# Altium project PCB_PowerSupply_1A - Copy.PrjPcb
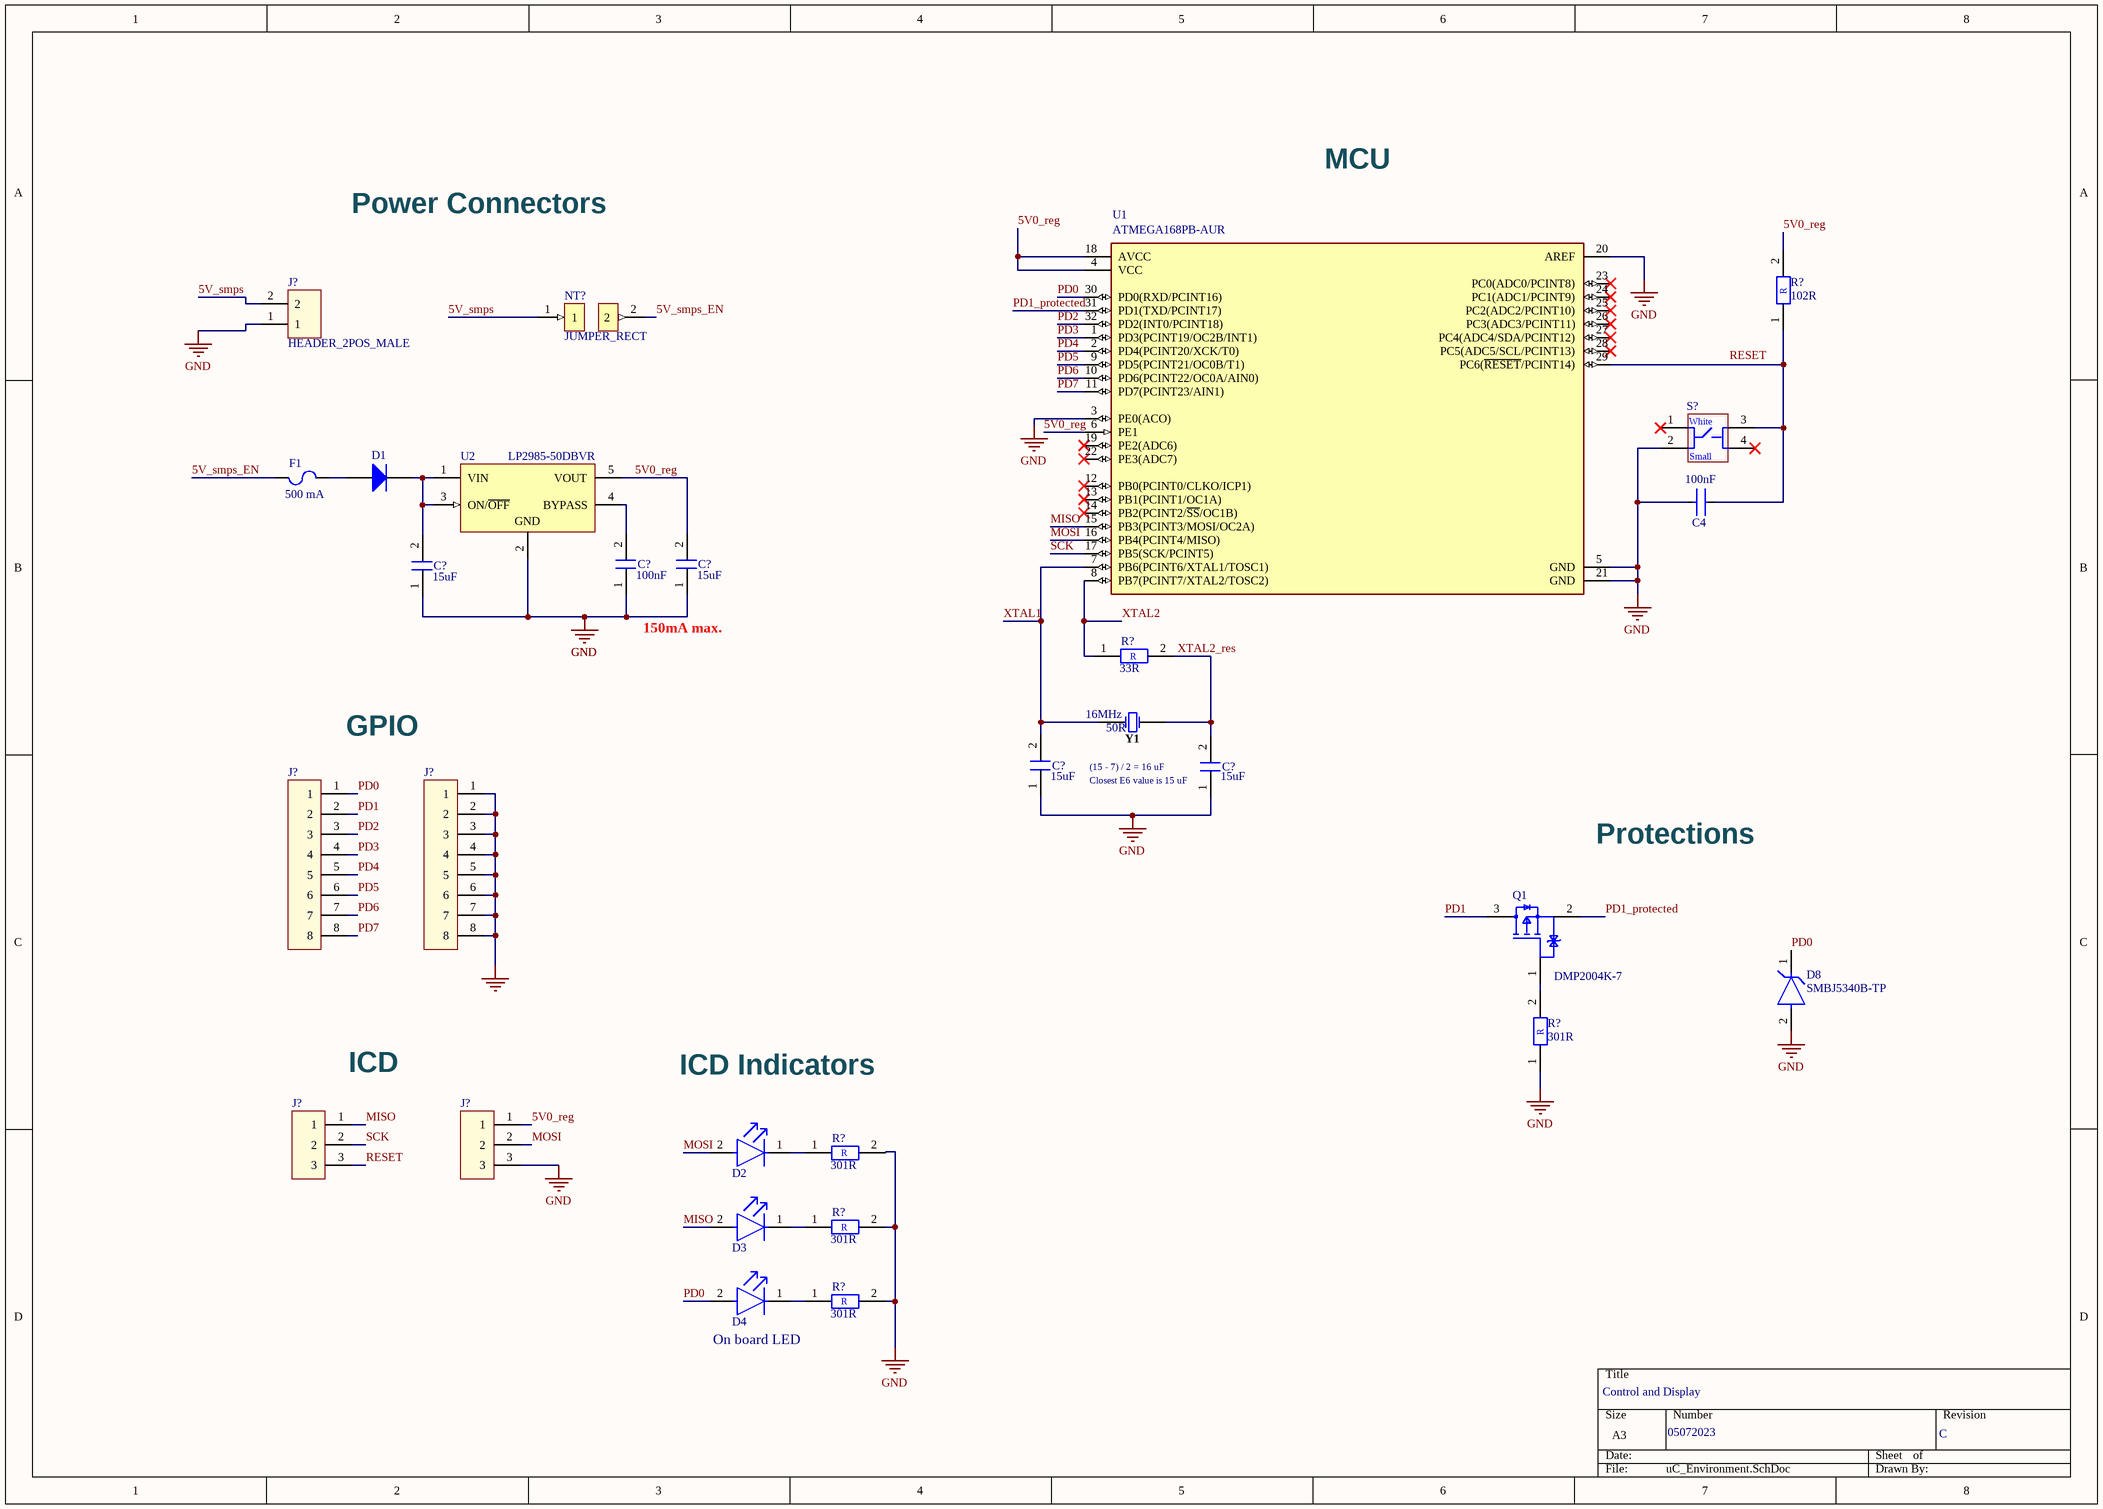
[diagram p0: uC_Environment.SchDoc]
PCB_CHECKER: - -----; PCB_CHECKER_APP_DATE: --/--/----; PCB_DESIGNER: Gustavo H. Meza; PCB_DWG_NO: <PCB DWG NO>; PCB_PART_NUMBER: <PCB PN>; PCB_REV: A; SCH_REV: A
3 sheets, 120 parts. Net scope: flat (ports and power ports of the same name join across sheets).
Board file: group1.PcbDoc
Sheets:
  uC_Environment.SchDoc
  Power_Distribution.SchDoc
  pulse_generator_pen.SchDoc

## Sheet uC_Environment.SchDoc
size A3; SheetNumber: 1; SheetTotal: 3; ENG_APP_DATE: --/--/--; DSN_APP_DATE: --/--/--; CHK_APP_DATE: --/--/--

### Parts
(Parts that share a designator on the sheet are numbered #1, #2 ... from top to bottom, then left to right.)
C4  Capacitance: 100nF  [FP-CL21-IPC_A]  (hidden comment: CL21B104KBCNNNC)
C?#1  Capacitance: 15uF  [0805_R]  (hidden comment: P.N.)
C?#2  Capacitance: 100nF  [0805_R]  (hidden comment: P.N.)
C?#3  Capacitance: 15uF  [0805_R]  (hidden comment: P.N.)
C?#4  Capacitance: 15uF  [0805_R]  (hidden comment: P.N.)
C?#5  Capacitance: 15uF  [0805_R]  (hidden comment: P.N.)
D1  SMAJ30A-E3/61  [VISH-DO-214AC-2_N]  (value not drawn)
D2  LTST-C191TBKT  [FP-LTST-C191TBKT-MFG]  (value not drawn)
D3  LTST-C191TBKT  [FP-LTST-C191TBKT-MFG]  (value not drawn)
D4  LTST-C191TBKT  [FP-LTST-C191TBKT-MFG]  (value not drawn)
D8  SMBJ5340B-TP  [FP-DO-214AA-MFG]
F1  Parameter 1: 500 mA  [0ZCJ0050AF2E-Footprint-1]  (hidden comment: 0ZCJ0050AF2E)
J?#1  HEADER_2POS_MALE  [HEADER_2POS_MALE_VERT_2.54MM]
J?#2  HEADER_8POS_MALE  [HEADER_8POS_MALE_VERT_2.54MM]  (value not drawn)
J?#3  HEADER_8POS_MALE  [HEADER_8POS_MALE_VERT_2.54MM]  (value not drawn)
J?#4  HEADER_3POS_MALE  [HEADER_3POS_MALE_VERT_2.54MM]  (value not drawn)
J?#5  HEADER_3POS_MALE  [HEADER_3POS_MALE_VERT_2.54MM]  (value not drawn)
NT?  JUMPER_RECT
Q1  DMP2004K-7  [FP-SOT23-MFG]
R?#1  Resistance: 102R  [0805_R]  (hidden comment: P.N.)
R?#2  Resistance: 33R  [0805_R]  (hidden comment: P.N.)
R?#3  Resistance: 301R  [0805_R]  (hidden comment: P.N.)
R?#4  Resistance: 301R  [0805_R]  (hidden comment: P.N.)
R?#5  Resistance: 301R  [0805_R]  (hidden comment: P.N.)
R?#6  Resistance: 301R  [0805_R]  (hidden comment: P.N.)
S?  TACT_SWITCH_SMD_5x3MM  [TACT_SWITCH_SMD_5x3MM]  (value not drawn)
U1  ATMEGA168PB-AUR  [FP-32A-MFG]
U2  LP2985-50DBVR  [DBV0005A_M]
Y1  Frequency: 16MHz  ESR (Equivalent Series Resistance): 50R  [ECS-160-20-3X-EN-TR-Footprint-1]  (hidden comment: ECS-160-20-3X-EN-TR)

### Nets
GND: C4.1 C?#1.1 C?#2.1 C?#3.1 C?#4.1 C?#5.1 D8.2(A) J?#1.1 J?#3.1 J?#3.2 J?#3.3 J?#3.4 J?#3.5 J?#3.6 J?#3.7 J?#3.8 J?#5.3 R?#3.1 R?#4.2 R?#5.2 R?#6.2 S?.2 U1.3(PE0(ACO)) U1.5(GND) U1.20(AREF) U1.21(GND) U2.2(GND)
5V0_reg: C?#3.2 J?#5.1 R?#1.2 U1.4(VCC) U1.6(PE1) U1.18(AVCC) U2.5(VOUT)
5V_smps: J?#1.2 NT?.1
5V_smps_EN: F1.1(IN) NT?.2
MISO: D3.2(A) J?#4.1 U1.15(PB3(PCINT3/MOSI/OC2A))
MOSI: D2.2(A) J?#5.2 U1.16(PB4(PCINT4/MISO))
PD0: D4.2(A) D8.1(C) J?#2.1 U1.30(PD0(RXD/PCINT16))
PD1: J?#2.2 Q1.3(D)
PD1_protected: Q1.2(S) U1.31(PD1(TXD/PCINT17))
PD2: J?#2.3 U1.32(PD2(INT0/PCINT18))
PD3: J?#2.4 U1.1(PD3(PCINT19/OC2B/INT1))
PD4: J?#2.5 U1.2(PD4(PCINT20/XCK/T0))
PD5: J?#2.6 U1.9(PD5(PCINT21/OC0B/T1))
PD6: J?#2.7 U1.10(PD6(PCINT22/OC0A/AIN0))
PD7: J?#2.8 U1.11(PD7(PCINT23/AIN1))
RESET: J?#4.3
SCK: J?#4.2 U1.17(PB5(SCK/PCINT5))
XTAL1: C?#4.2 U1.7(PB6(PCINT6/XTAL1/TOSC1)) Y1.2
XTAL2: R?#2.1 U1.8(PB7(PCINT7/XTAL2/TOSC2))
XTAL2_res: C?#5.2 R?#2.2 Y1.1
NetC4_2: C4.2 R?#1.1 S?.3 U1.29(PC6(~{RESET}/PCINT14))
NetC?#1_2: C?#1.2 D1.1(K) U2.1(VIN) U2.3(ON/~{OFF})
NetC?#2_2: C?#2.2 U2.4(BYPASS)
NetD1_2: D1.2(A) F1.2(OUT)
NetD2_1: D2.1(C) R?#4.1
NetD3_1: D3.1(C) R?#5.1
NetD4_1: D4.1(C) R?#6.1
NetQ1_1: Q1.1(G) R?#3.2

Not connected (* = marked no-connect by the designer): S? 1* 4*; U1 12(PB0(PCINT0/CLKO/ICP1))* 13(PB1(PCINT1/OC1A))* 14(PB2(PCINT2/~{SS}/OC1B))* 19(PE2(ADC6))* 22(PE3(ADC7))* 23(PC0(ADC0/PCINT8))* 24(PC1(ADC1/PCINT9))* 25(PC2(ADC2/PCINT10))* 26(PC3(ADC3/PCINT11))* 27(PC4(ADC4/SDA/PCINT12))* 28(PC5(ADC5/SCL/PCINT13))*

### Notes on the sheet
- MCU
- Power Connectors
- (near C?#3) 150mA max.
- GPIO
- (15 - 7) / 2 = 16 uF
- (near C?#5) Closest E6 value is 15 uF
- Protections
- (near J?#4) ICD
- ICD Indicators
- On board LED
- Control and Display
- 05072023
- C
- Labels drawn without touching a wire or pin: RESET
- DWG. NO.
- REV.
- SHT.
- THIS DOCUMENT AND THE DATA DISCLOSED HEREIN OR HEREWITH IS THE PROPERTY OF ALTIUM LIMITED AND MAY BE FREELY DISTRIBUTED IN WHOLE. NO RIGHTS ARE RESERVED OR EXPRESS OR IMPLIED WARANTEE GIVEN.
- REVISION
- DESCRIPTION
- DATE
- APPROVED
- ENG:
- APPROVALS
- PROJECT
- DSN:
- CHK:
- REFERENCE DOCUMENTS
- PROJECT REVISION:
- TITLE
- DOCUMENT REVISION:
- DESIGN ITEM:
- BOM:
- FAB DWG:
- PCB DWG:
- ASSY DWG:
- SCALE:
- SIZE
- B
- CAGE CODE
- FILE NAME
- DWG NO.
- SHEET
- OF
- REV
- (in symbol 0805_R) R
- (in symbol TACT_SWITCH_SMD_5x3MM) White; Small

### Library data of the parts
C4 = CMP-2000-05017-2: CL21 Series 0805 100nF 50V ±10% Tolerance X7R Multilayer Ceramic Chip Capacitor; Depth: 1.25mm; Height: 0.85mm; Width: 0.049inch; Tolerance: 10%; Case Code (Metric): 2012; Case Code (Imperial): 0805; Material: Ceramic; Thickness: 0.037inch; Min Operating Temperature: -55°C; Contact Plating: Tin; Length: 2mm; Mount: Surface Mount; Voltage Rating (DC): 50V; Lead Free: Lead Free; Dielectric: X7R; Radiation Hardening: No; Voltage Rating: 50V; Case/Package: 0805; Packaging: Tape and Reel; Max Operating Temperature: 125°C; Voltage: 50V
C?#1-C?#5 = 0805_C: Generic 0805 Capacitor; Voltage Rating: 10V; Dielectric: XR7
D1 = CMP-0548-00228-2: Transient Voltage Suppressor, 6.40 to 231 V, 30 V Stand-off Voltage, Uni-Directional, -55 to 155 degC, 2-pin DO-214AC, Pb-Free, Tape and Reel; Manufacturer: Vishay Semiconductor; ID (uA): 1; VWM (V): 30; IFSM: 40 A; PPPM (W): 400, 300; VBR Uni-Directional (V): 6.4 to 231; Mounting Technology: Surface Mount; Packing: Tape and Reel; ComponentLink1URL: http://www.vishay.com/; ComponentLink3URL: http://www.vishay.com/docs/88390/smaj50a.pdf; DatasheetVersion: 12/8/2013; RoHS: TRUE; PartNumber: SMAJ30A-E3/61; PackageReference: DO-214AC-2; ComponentLink2URL: http://www.vishay.com/docs/88390/smaj50a.pdf; ComponentLink1Description: Manufacturer URL; Operating Junction and Storage Temperature Range: -55 to 150 degC; PackageDescription: 2-Pin DO-214AC (SMA), Body 4.245 x 2.665 mm; ComponentLink3Description: Package Specification; ComponentLink2Description: Datasheet
D2-D4 = CMP-22017-000008-1: LED BLUE CLEAR CHIP SMD; Lens Color: Colorless; Dominant Wavelength: 475nm; Forward Current: 20mA; Wavelength: 468nm; Viewing Angle: 130°; Power Dissipation: 76mW; Luminous Intensity: 180mcd; Reverse Voltage: 5V; Number of Elements: 1; Lens Style: Diffused; Forward Voltage: 3.8V; Max Power Dissipation: 75mW; Case Code (Metric): 1608; Packaging: Tape and Reel; Case/Package: 0603; Depth: 1.6mm; Mount: Surface Mount; Lead Free: Lead Free; Min Operating Temperature: -20°C; Lens Transparency: Clear; Illumination Color: Blue; Height: 0.55mm; Test Current: 20mA; Case Code (Imperial): 0603; Max Operating Temperature: 80°C; Number of Pins: 2; Length: 0.8mm; Radiation Hardening: No; Package Quantity: 1; Number of LEDs: 1; Width: 0.8mm; Color: Blue
D8 = CMP-56208-000001-1: DIODE ZENER 6V 5W DO214AA; Manufacturer: Micro Commercial Components; Zener Impedance: 1Ω; Max Reverse Leakage Current: 1uA; Max Junction Temp: +150°C; Forward Current: 1A; Standoff Height: 0.05mm; Package: DO-214AA; Mouser Description: SMBJ Series 5 W 6 V 1 A Zener Diode-DO-214AA; Device Class L3: Zener Diodes; RoHS: TRUE; Power Dissipation: 5W; Nom Zener Voltage: 6V; Temperature Range High: +150°C; Lead Free: Yes; Category: Diode; Temperature: -55°C to +150°C; Height: 2.41mm; Automotive: No; Digikey Description: DIODE ZENER 6V 5W DO214AA; ComponentLink2Description: Datasheet; Octopart: https://octopart.com/smbj5340b-tp-mcc-19246153; ComponentLink2URL: https://www.mccsemi.com/pdf/Products/SMBJ5338B-SMBJ5388B%28SMB%29.pdf; Manufacturer Part Number: SMBJ5340B-TP; Temperature Range Low: -55°C; Device Class L1: Discrete Semiconductors; Device Class L2: Diodes
F1 = CMP-005-00013-2: PTC Resettable Fuse 0.5A(hold) 1A(trip) 24VDC 100A 0.6W 0.1s 0.15Ohm SMD Solder Pad 3.5 X 1.8 X 1.3mm T/R; Approvals: UL,TUV; Case Code (Metric): 3216; Case Code (Imperial): 1206; Case/Package: 1206
NT? = JUMPER_RECT: Small rectangular jumper
Q1 = CMP-12801-000029-1: MOSFET P-CH 20V 600MA SOT23-3; Manufacturer: Diodes Inc.; Max Junction Temp: +150°C; Turn On Delay Time: 8.5ns; Gate To Source Voltage: 8V; Input Capacitace At Vds: 175pF @ -16V; Rthja Max: 227°C/W; Drain To Source Resistance: 1.1Ω; Turn Off Delay Time: 20.2ns; Standoff Height: 0.013mm; Drain To Source Breakdown Voltage: -20V; Number Of P Channels: 1; Power Dissipation: 550mW; Pulse Drain Current: -1.9A; Depletion Mode: False; Max Forward Diode Voltage: -1.2V; Threshold Vgs Min: -0.5V; Threshold Vgs Max: -1V; Continuous Drain Current: -600mA; Manufacturer Part Number: DMP2004K-7; Height: 1.1mm; ComponentLink2Description: Datasheet; ComponentLink2URL: https://www.diodes.com/assets/Datasheets/ds30933.pdf; Package: SOT23; Footprint Url: https://www.diodes.com/assets/Package-Files/SOT23.pdf; Lead Free: Yes; Octopart: https://octopart.com/dmp2004k-7-diodes+inc.-7151877; Digikey Description: MOSFET P-CH 20V 600MA SOT23-3; Device Class L1: Discrete Semiconductors; Drain To Source Voltage: -20V; Mouser Description: MOSFET P-Channel; Number Of Channels: 1; Device Class L3: MOSFETs; Temperature: -55°C to +150°C; Category: Trans; Device Class L2: Transistors; Automotive: No; Temperature Range High: +150°C; RoHS: TRUE; Temperature Range Low: -55°C
R?#1-R?#6 = 0805_R: Generic 0805 Resistor; Power Rating: 0.5W
U1 = CMP-06276-000190-1: IC MCU 8BIT 16KB FLASH 32TQFP; RoHS Compliant: Yes
U2 = CMP-0758-00084-2: Single Output Low Noise LDO, 150 mA, Fixed 5 V Output, 1.5% Tolerance, 2.2 to 16 V Input, Low IQ, 5-Pin SOT-23 (DBV), -40 to 125 degC, Green (RoHS & no Sb/Br), Tape and Reel; Manufacturer: Texas Instruments; Accuracy (%): 1.5; Iout (Max) (A): 0.15; Fixed Output Options (V): 5; Vdo (Typ) (mV): 280; Output Options: Fixed Output; Iq (Typ) (mA): 0.85; DatasheetVersion: SLVS522N; PackageDescription: 5-Pin Plastic Small Outline, Body 2.9 x 1.6 mm, Pitch 0.95 mm; RoHS: TRUE; ComponentLink3URL: http://www.ti.com/litv/pdf/mpds018j; PartNumber: LP2985-50DBVR; PackageReference: DBV0005A; ComponentLink2URL: http://www.ti.com/lit/ds/symlink/lp2985-50.pdf; Mounting Technology: Surface Mount; ComponentLink1Description: Manufacturer URL; Vin (V): 2.2 to 16; ComponentLink3Description: Package Specification; ComponentLink1URL: http://www.ti.com/; PackageVersion: 4073253-4/L; ComponentLink2Description: Datasheet; Packing: Tape and Reel; Operating Temperature Range (degC): -40 to 125
Y1 = CMP-003-00030-1: Crystal 16MHz ±30ppm (Tol) ±50ppm (Stability) 20pF FUND 50Ohm 2-Pin HC-49/USX SMD T/R; Frequency Tolerance: 30ppm; Frequency Stability: 50ppm

## Sheet Power_Distribution.SchDoc
size B; SheetNumber: 2; SheetTotal: 3
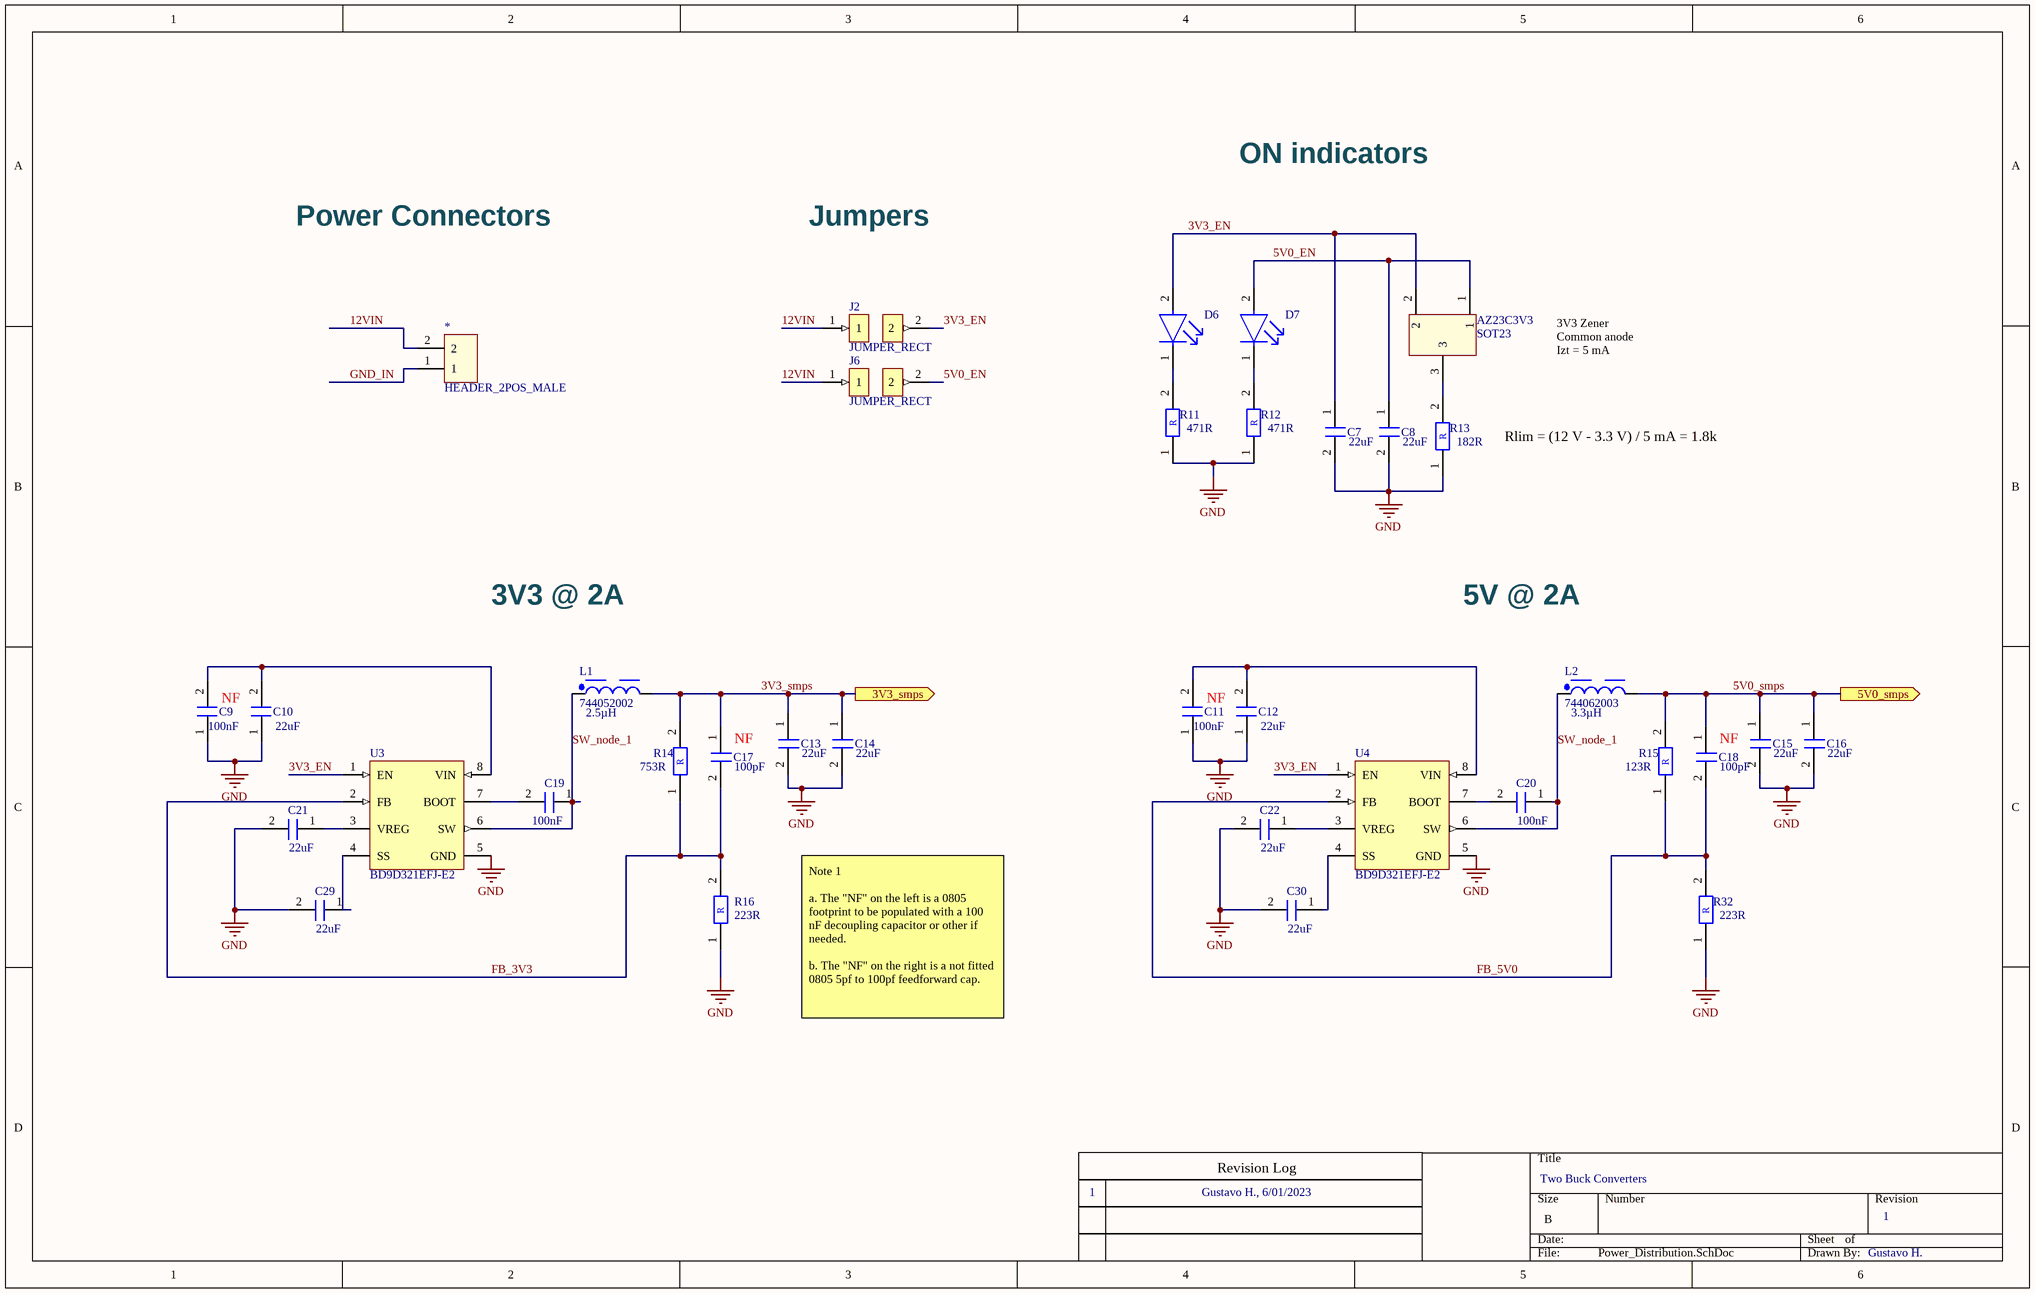
[diagram p1: Power_Distribution.SchDoc]

### Parts
*  HEADER_2POS_MALE  [HEADER_2POS_MALE_VERT_2.54MM]
AZ23C3V3  SOT23  [SOT23]
C7  Capacitance: 22uF  [0805_R]  (hidden comment: P.N.)
C8  Capacitance: 22uF  [0805_R]  (hidden comment: P.N.)
C9  Capacitance: 100nF  [0805_R]  (hidden comment: P.N.)
C10  Capacitance: 22uF  [0805_R]  (hidden comment: P.N.)
C11  Capacitance: 100nF  [0805_R]  (hidden comment: P.N.)
C12  Capacitance: 22uF  [0805_R]  (hidden comment: P.N.)
C13  Capacitance: 22uF  [0805_R]  (hidden comment: P.N.)
C14  Capacitance: 22uF  [0805_R]  (hidden comment: P.N.)
C15  Capacitance: 22uF  [0805_R]  (hidden comment: P.N.)
C16  Capacitance: 22uF  [0805_R]  (hidden comment: P.N.)
C17  Capacitance: 100pF  [0805_R]  (hidden comment: P.N.)
C18  Capacitance: 100pF  [0805_R]  (hidden comment: P.N.)
C19  Capacitance: 100nF  [0805_R]  (hidden comment: P.N.)
C20  Capacitance: 100nF  [0805_R]  (hidden comment: P.N.)
C21  Capacitance: 22uF  [0805_R]  (hidden comment: P.N.)
C22  Capacitance: 22uF  [0805_R]  (hidden comment: P.N.)
C29  Capacitance: 22uF  [0805_R]  (hidden comment: P.N.)
C30  Capacitance: 22uF  [0805_R]  (hidden comment: P.N.)
D6  LTST-C191TBKT  [FP-LTST-C191TBKT-MFG]  (value not drawn)
D7  LTST-C191TBKT  [FP-LTST-C191TBKT-MFG]  (value not drawn)
J2  JUMPER_RECT
J6  JUMPER_RECT
L1  744052002  Inductance: 2.5µH  [WE-TPC_5818]
L2  744062003  Inductance: 3.3µH  [WE-TPC_6823]
R11  Resistance: 471R  [0805_R]  (hidden comment: P.N.)
R12  Resistance: 471R  [0805_R]  (hidden comment: P.N.)
R13  Resistance: 182R  [0805_R]  (hidden comment: P.N.)
R14  Resistance: 753R  [0805_R]  (hidden comment: P.N.)
R15  Resistance: 123R  [0805_R]  (hidden comment: P.N.)
R16  Resistance: 223R  [0805_R]  (hidden comment: P.N.)
R32  Resistance: 223R  [0805_R]  (hidden comment: P.N.)
U3  BD9D321EFJ-E2  [SOIC127P600X100-8N]
U4  BD9D321EFJ-E2  [SOIC127P600X100-8N]

### Ports
3V3_smps (out), 5V0_smps (out)

### Nets
GND: C7.2 C8.2 C9.1 C10.1 C11.1 C12.1 C13.2 C14.2 C15.2 C16.2 C21.2 C22.2 C29.2 C30.2 R11.1 R12.1 R13.1 R16.1 R32.1 U3.5(GND) U4.5(GND)
3V3_EN: AZ23C3V3.2 C7.1 D6.2(A) J2.2 U3.1(EN) U4.1(EN)
3V3_smps: C13.1 C14.1 C17.1 L1.2 R14.2 ; port 3V3_smps
5V0_EN: AZ23C3V3.1 C8.1 D7.2(A) J6.2
5V0_smps: C15.1 C16.1 C18.1 L2.2 R15.2 ; port 5V0_smps
12VIN: *.2 J2.1 J6.1
FB_3V3: C17.2 R14.1 R16.2 U3.2(FB)
FB_5V0: C18.2 R15.1 R32.2 U4.2(FB)
GND_IN: *.1
SW_node_1: C19.1 C20.1 L1.1 L2.1 U3.6(SW) U4.6(SW)
NetAZ23C3V3_3: AZ23C3V3.3 R13.2
NetC9_2: C9.2 C10.2 U3.8(VIN)
NetC11_2: C11.2 C12.2 U4.8(VIN)
NetC19_2: C19.2 U3.7(BOOT)
NetC20_2: C20.2 U4.7(BOOT)
NetC21_1: C21.1 U3.3(VREG)
NetC22_1: C22.1 U4.3(VREG)
NetC29_1: C29.1 U3.4(SS)
NetC30_1: C30.1 U4.4(SS)
NetD6_1: D6.1(C) R11.2
NetD7_1: D7.1(C) R12.2

### Notes on the sheet
- ON indicators
- Power Connectors
- Jumpers
- 3V3 Zener
  Common anode
  Izt = 5 mA
- (near R13) Rlim = (12 V - 3.3 V) / 5 mA = 1.8k
- 3V3 @ 2A
- 5V @ 2A
- (near C9) NF
- (near C11) NF
- (near C17) NF
- (near C18) NF
- Note 1
  a. The "NF" on the left is a 0805 footprint to be populated with a 100 nF decoupling capacitor or other if needed.
  b. The "NF" on the right is a not fitted 0805 5pf to 100pf feedforward cap.
- Two Buck Converters
- 1
- Gustavo H., 6/01/2023
- Gustavo H.
- Revision Log
- (in symbol 0805_R) R

### Library data of the parts
C7-C22 C29 C30 = 0805_C: as C?#1 on sheet uC_Environment
D6 D7 = CMP-22017-000008-1: as D2 on sheet uC_Environment; Case Code (Metric): 1608; Packaging: Tape and Reel; Case/Package: 0603; Depth: 1.6mm; Mount: Surface Mount; Lead Free: Lead Free; Min Operating Temperature: -20°C; Lens Transparency: Clear; Illumination Color: Blue; Height: 0.55mm; Test Current: 20mA; Case Code (Imperial): 0603; Max Operating Temperature: 80°C; Number of Pins: 2; Length: 0.8mm; Radiation Hardening: No; Package Quantity: 1; Number of LEDs: 1; Width: 0.8mm; Color: Blue
J2 J6 = JUMPER_RECT: Small rectangular jumper
L1 = CMP-0227-00410-3: NexarPartId: 22866863; Self Resonant Frequency: 85MHz; Inductance Tolerance: 30%; DC Resistance (DCR): 30mΩ; Current Rating: 2.4A; Height: 1.8mm; Ambient Temperature Range Low: -40°C; Min Operating Temperature: -40°C; Packaging: Cut Tape (CT); Number of Pins: 2; Length: 5.8mm; RoHS: Compliant; Max Operating Temperature: 125°C; Ambient Temperature Range High: 95°C; Width: 5.8mm
L2 = CMP-0227-00249-3: NexarPartId: 24533145; Saturation Current: 2.5A; Tolerance: 30%; DC Resistance (DCR): 20mΩ; Current Rating: 2.8A; Core Material: Ferrite; Self Resonant Frequency: 55MHz; Test Frequency: 100kHz; Shielding: Shielded; Mount: Surface Mount; RoHS: Compliant; Ambient Temperature Range High: 95°C; Number of Pins: 2; Case/Package: 2727; Max Operating Temperature: 125°C; Termination: SMD/SMT; Width: 6.8mm; Inductance Tolerance: 30%; Composition: Wirewound; REACH SVHC: Unknown; Ambient Temperature Range Low: -40°C; Case Code (Metric): 6868; Height: 2.3mm; Height - Seated (Max): 2.4892mm; Max DC Current: 2.8A; Lead Free: Lead Free; RMS Current (Irms): 2.8A; Length: 6.8mm; Min Operating Temperature: -40°C; Case Code (Imperial): 2727; Packaging: Tape & Reel (TR)
R11-R16 R32 = 0805_R: as R?#1 on sheet uC_Environment
U3 U4 = CMP-019-00049-1: ICREGBUCKADJ3ASYNC8HTSOP; Max Output current: 3A; Number of Outputs: 1; Max Output Voltage: 7V; Min Output Voltage: 765mV; Min Supply Voltage: 4.5V; Max Supply Voltage: 18V; Output Configuration: Positive; Output Type: Adjustable; Switching Frequency: 700kHz; Synchronous Rectifier: Yes; Pins: 8; Min Operating Temperature: -40°C; RoHS Compliant: Yes; Mounting Technology: Surface Mount; Package Quantity: 2500; Output Current: 3A; Max Operating Temperature: 85°C; Lead Free: Lead Free; Series: -; Reach SVHC Compliant: Unknown; Packaging: Tape and Reel; Output Voltage: 7V; Operating Supply Voltage: 18V; Min Input Voltage: 4.5V

## Sheet pulse_generator_pen.SchDoc
size A4; SheetNumber: 3; SheetTotal: 3
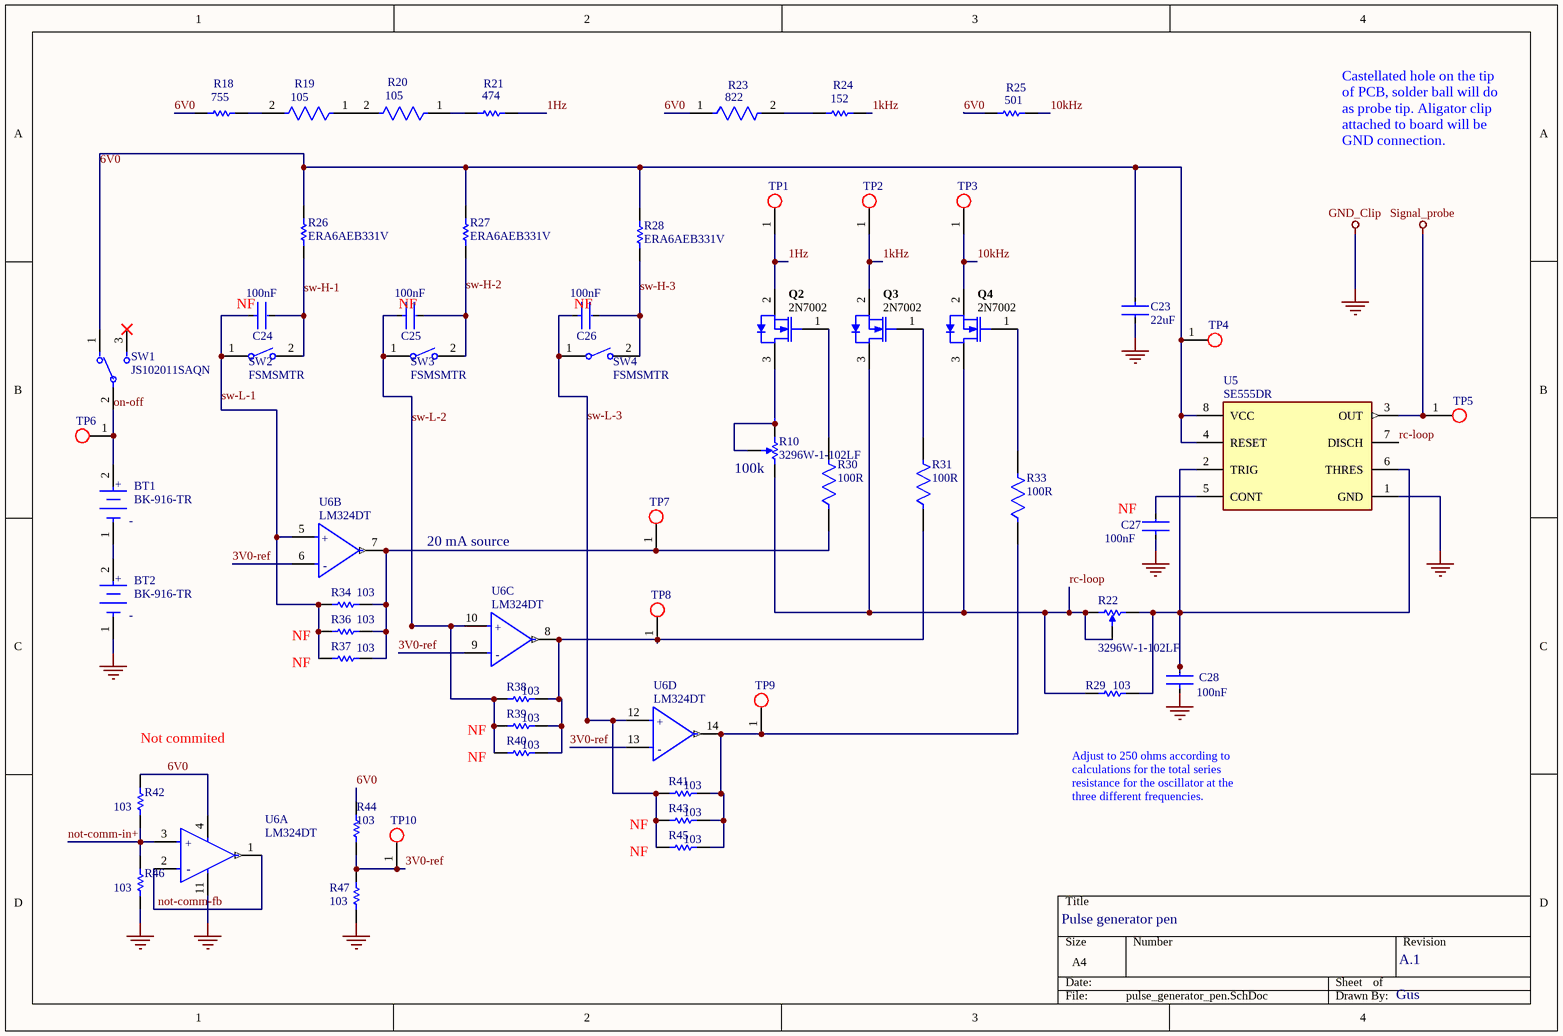
[diagram p2: pulse_generator_pen.SchDoc]

### Parts
BT1  BK-916-TR  [FP-BK-916-TR-MFG]
BT2  BK-916-TR  [FP-BK-916-TR-MFG]
C23  Capacitance: 22uF  [FP-C2012-125-0_2-IPC_A]  (hidden comment: C2012X5R1V226M125AC)
C24  Capacitance: 100nF  [FP-CL21-IPC_A]  (hidden comment: CL21B104KBCNNNC)
C25  Capacitance: 100nF  [FP-CL21-IPC_A]  (hidden comment: CL21B104KBCNNNC)
C26  Capacitance: 100nF  [FP-CL21-IPC_A]  (hidden comment: CL21B104KBCNNNC)
C27  Capacitance: 100nF  [FP-CL21-IPC_A]  (hidden comment: CL21B104KBCNNNC)
C28  Capacitance: 100nF  [FP-CL21-IPC_A]  (hidden comment: CL21B104KBCNNNC)
Q2  2N7002  [INF-PG-SOT23_M]
Q3  2N7002  [INF-PG-SOT23_M]
Q4  2N7002  [INF-PG-SOT23_M]
R10  3296W-1-102LF  [BOUR-3296W-1-3]
R18  Resistance: 755  [RESC2013X50X30LL20T20]  (hidden comment: CRCW08057M50JNEA)
R19  Resistance: 105  [FP-ERJ6EN-IPC_A]  (hidden comment: ERJ-6ENF1004V)
R20  Resistance: 105  [FP-ERJ6EN-IPC_A]  (hidden comment: ERJ-6ENF1004V)
R21  Resistance: 474  [RESC2013X70X40ML20T20]  (hidden comment: ERJ6ENF4703V)
R22  3296W-1-102LF  [BOUR-3296W-1-3]
R23  Resistance: 822  [FP-RC2012-IPC_A]  (hidden comment: RC2012J822CS)
R24  Resistance: 152  [RESC2013X60X35LL10T20]  (hidden comment: RC0805FR-071K5L)
R25  Resistance: 501  [RESC2013X58X38LL25T25]  (hidden comment: WSLP0805R0500FEA)
R26  ERA6AEB331V  [RESC2013X60X40LL20T25]
R27  ERA6AEB331V  [RESC2013X60X40LL20T25]
R28  ERA6AEB331V  [RESC2013X60X40LL20T25]
R29  Resistance: 103  [RESC2013X60X35NL10T20]  (hidden comment: RC0805FR-0710KL)
R30  Resistance: 100R  [FP-CRCW0805-HPe3-IPC_A]  (hidden comment: CRCW0805100RFKEAHP)
R31  Resistance: 100R  [FP-CRCW0805-HPe3-IPC_A]  (hidden comment: CRCW0805100RFKEAHP)
R33  Resistance: 100R  [FP-CRCW0805-HPe3-IPC_A]  (hidden comment: CRCW0805100RFKEAHP)
R34  Resistance: 103  [RESC2013X60X35NL10T20]  (hidden comment: RC0805FR-0710KL)
R36  Resistance: 103  [RESC2013X60X35NL10T20]  (hidden comment: RC0805FR-0710KL)
R37  Resistance: 103  [RESC2013X60X35NL10T20]  (hidden comment: RC0805FR-0710KL)
R38  Resistance: 103  [RESC2013X60X35NL10T20]  (hidden comment: RC0805FR-0710KL)
R39  Resistance: 103  [RESC2013X60X35NL10T20]  (hidden comment: RC0805FR-0710KL)
R40  Resistance: 103  [RESC2013X60X35NL10T20]  (hidden comment: RC0805FR-0710KL)
R41  Resistance: 103  [RESC2013X60X35NL10T20]  (hidden comment: RC0805FR-0710KL)
R42  Resistance: 103  [RESC2013X60X35NL10T20]  (hidden comment: RC0805FR-0710KL)
R43  Resistance: 103  [RESC2013X60X35NL10T20]  (hidden comment: RC0805FR-0710KL)
R44  Resistance: 103  [RESC2013X60X35NL10T20]  (hidden comment: RC0805FR-0710KL)
R45  Resistance: 103  [RESC2013X60X35NL10T20]  (hidden comment: RC0805FR-0710KL)
R46  Resistance: 103  [RESC2013X60X35NL10T20]  (hidden comment: RC0805FR-0710KL)
R47  Resistance: 103  [RESC2013X60X35NL10T20]  (hidden comment: RC0805FR-0710KL)
SW1  JS102011SAQN  [FP-JS102011SAQN-MFG]
SW2  FSMSMTR  [TECO-FSMSMTR_V]
SW3  FSMSMTR  [TECO-FSMSMTR_V]
SW4  FSMSMTR  [TECO-FSMSMTR_V]
TP1  TP_opening  [New footprint 1]  (value not drawn)
TP2  TP_opening  [New footprint 1]  (value not drawn)
TP3  TP_opening  [New footprint 1]  (value not drawn)
TP4  TP_opening  [New footprint 1]  (value not drawn)
TP5  TP_opening  [New footprint 1]  (value not drawn)
TP6  TP_opening  [New footprint 1]  (value not drawn)
TP7  TP_opening  [New footprint 1]  (value not drawn)
TP8  TP_opening  [New footprint 1]  (value not drawn)
TP9  TP_opening  [New footprint 1]  (value not drawn)
TP10  TP_opening  [New footprint 1]  (value not drawn)
U5  SE555DR  [FP-D0008A-MFG]
U6  LM324DT  [FP-SO-14-MFG]  (parts A,B,C,D of 4)

### Nets
GND: BT2.1(C) C23.2 C27.1 C28.1 R46.1 R47.1 U5.1(GND) U6.11(VCC-)  [also labelled GND_Clip]
Signal_probe: TP5.1 U5.3(OUT)
1Hz: Q2.2(SOURCE) R21.2 TP1.1
1kHz: Q3.2(SOURCE) R24.2 TP2.1
3V0-ref: R44.1 R47.2 TP10.1 U6.6(Inverting_Input_2) U6.9(Inverting_Input_3) U6.13(Inverting_Input_4)
6V0: C23.1 R18.2 R23.1 R25.1 R26.1 R27.1 R28.1 R42.2 R44.2 SW1.1 TP4.1 U5.4(RESET) U5.8(VCC) U6.4(VCC+)
10kHz: Q4.2(SOURCE) R25.2 TP3.1
not-comm-fb: U6.1(Output_1) U6.2(Inverting_Input_1)
not-comm-in+: R42.1 R46.2 U6.3(Non-Inverting_Input_1)
on-off: BT1.2(A) SW1.2(C) TP6.1
rc-loop: Q3.3(DRAIN) Q4.3(DRAIN) R10.2(B) R22.1(A) R22.3(TAP) R29.2 U5.7(DISCH)
sw-H-1: C24.2 R26.2 SW2.2
sw-H-2: C25.2 R27.2 SW3.2
sw-H-3: C26.2 R28.2 SW4.2
sw-L-1: C24.1 R34.2 R36.2 R37.2 SW2.1 U6.5(Non-Inverting_Input_2)
sw-L-2: C25.1 R38.2 R39.2 R40.2 SW3.1 U6.10(Non-Inverting_Input_3)
sw-L-3: C26.1 R41.2 R43.2 R45.2 SW4.1 U6.12(Non-Inverting_Input_4)
NetBT1_1: BT1.1(C) BT2.2(A)
NetC27_2: C27.2 U5.5(CONT)
NetC28_2: C28.2 R22.2(B) R29.1 U5.2(TRIG) U5.6(THRES)
NetQ2_1: Q2.1(GATE) R30.2
NetQ2_3: Q2.3(DRAIN) R10.1(A) R10.3(TAP)
NetQ3_1: Q3.1(GATE) R31.2
NetQ4_1: Q4.1(GATE) R33.2
NetR18_1: R18.1 R19.2
NetR19_1: R19.1 R20.2
NetR20_1: R20.1 R21.1
NetR23_2: R23.2 R24.1
NetR30_1: R30.1 R34.1 R36.1 R37.1 TP7.1 U6.7(Output_2)
NetR31_1: R31.1 R38.1 R39.1 R40.1 TP8.1 U6.8(Output_3)
NetR33_1: R33.1 R41.1 R43.1 R45.1 TP9.1 U6.14(Output_4)

Not connected (* = marked no-connect by the designer): SW1 3*

### Notes on the sheet
- Castellated hole on the tip of PCB, solder ball will do as probe tip. Aligator clip attached to board will be GND connection.
- (near C24) NF
- (near C25) NF
- (near C26) NF
- (near R10) 100k
- (near C27) NF
- 20 mA source
- NF
- (near R42) Not commited
- Adjust to 250 ohms according to calculations for the total series resistance for the oscillator at the three different frequencies.
- Pulse generator pen
- A.1
- Gus
- (in symbol CMP-12131-000005-1, part A) +; -
- (in symbol CMP-12131-000005-1, part B) +; -
- (in symbol CMP-12131-000005-1, part C) +; -
- (in symbol CMP-12131-000005-1, part D) +; -
- (in symbol CMP-136216-000004-1) +; -

### Library data of the parts
BT1 BT2 = CMP-136216-000004-1: BATTERY RETAINER COIN 12MM SMD; Number of Cells: 1; Termination: SMD/SMT; Mount: Surface Mount
C23 = CMP-2000-06038-3: Multilayer Ceramic Capacitors 22μF ±20% 35V X5R SMD 0805; Tolerance: 20%; RoHS Compliant: Yes; Height: 1.25mm; Termination: SMD/SMT; Case/Package: 0805; Thickness: 0.057inch; Max Operating Temperature: 85°C; Min Operating Temperature: -55°C; Voltage Rating (DC): 35V; Length: 0.079inch; Dielectric: X5R; Dielectric Material: Ceramic; Voltage Rating: 35V; Mount: Surface Mount; Package Quantity: 2000; Lead Free: Lead Free; Weight: 0.000194oz; REACH SVHC: No SVHC; Width: 0.049inch; Packaging: Tape and Reel; Series: C; Case Code (Metric): 2012; Case Code (Imperial): 0805
C24-C28 = CMP-2000-05017-2: as C4 on sheet uC_Environment; Depth: 1.25mm; Height: 0.85mm; Width: 0.049inch; Tolerance: 10%; Case Code (Metric): 2012; Case Code (Imperial): 0805; Material: Ceramic; Thickness: 0.037inch; Min Operating Temperature: -55°C; Contact Plating: Tin; Length: 2mm; Mount: Surface Mount; Voltage Rating (DC): 50V; Lead Free: Lead Free; Dielectric: X7R; Radiation Hardening: No; Voltage Rating: 50V; Case/Package: 0805; Packaging: Tape and Reel; Max Operating Temperature: 125°C; Voltage: 50V
Q2-Q4 = CMP-1149-00026-1: N-Channel OptiMOS Small-Signal-Transistor, 60 V VDS, 0.3 A ID, -55 to 150 degC, PG-SOT23, Reel, Green; Manufacturer: Infineon; RDS (on) (max) (@4.5V): 4,000 mOhm; VDS (max): 60 V; IDpuls (max): 1.2Â A; QG: 0.4Â nC; RDS (on) (max): 3,000 mOhm; RthJA (max): 250 K/W; ID (max): 0.3Â A; VGS(th) (max): 2.5Â V; VGS(th) (min): 1.5Â V; Green: TRUE; Ptot (max): 0.5Â W; PackageDescription: 3-Pin Small Outline Transistor Package, 2.9 x 1.3 mm Body, 0.95 mm Pitch; Halogen-free: TRUE; ComponentLink2Description: Datasheet; ComponentLink1URL: http://www.infineon.com/; Packing: Reel; DatasheetVersion: Rev. 2.4; PartNumber: 2N7002; PackageReference: PG-SOT23; PackageVersion: Apr-08; ComponentLink3URL: http://www.infineon.com/dgdl/SOT23-Package_Overview.pdf?folderId=db3a30431936bc4b0119532290053c66&fileId=db3a30431936bc4b0119533468123c85; ComponentLink1Description: Manufacturer URL; Mounting Technology: Surface Mount; ComponentLink3Description: Package Specification; ComponentLink2URL: http://www.infineon.com/dgdl/2N7002_Rev2.4.pdf?folderId=db3a3043156fd573011622e10b5c1f67&fileId=db3a304319bc939a0119c2a9461e79e6
R10 R22 = CMP-1747-00002-1: Square Trimpot(R) Trimming Potentiometer, 1000 Ohm, -55 to 125 degC, 3-Pin THD, RoHS, Tube; Case\Package: 0603; Tolerance: 1%; Power Rating: 100 mW; Voltage Rating: 75 V; Resistance: 4.7 kohm; ComponentLink2URL: http://www.bourns.com/docs/Product-Datasheets/3296.pdf; Packaging: Tape and Reel; REACH SVHC: Yes; ComponentLink1URL: http://www.bourns.com/; Case Code (Metric): 1608; Width: 0.8 mm; ComponentLink1Description: Manufacturer URL; DatasheetVersion: May-16; Max Operating Temperature: 155 degC; PackageReference: 3296W-1-3; PackageDescription: 3-Pin Through Hole Device, Body 9.53 x 4.83 mm, Pitch 2.54 mm; Weight: 7.1E-05 oz; ComponentLink2Description: Datasheet; RoHSCompliant: true; Min Operating Temperature: -55 degC; Radiation Hardening: No; Case Code (Imperial): 0603; Length: 1.6 mm; Package Quantity: 5000; Pins: 2; Mount: Surface Mount; Height: 0.45 mm
R18 = CMP-2001-04122-1: Manufacturer: Vishay Dale; Part Number: CRCW08057M50JNEA
R19 R20 = CMP-2001-04378-6: RES SMD 1M OHM 1% 1/8W 0805; Temperature Coefficient: 100ppm/°C; Power Rating: 125mW; Voltage Rating: 150V; Length: 2mm; Height: 0.6mm; Technology: THICK FILM; Max Operating Temperature: 155°C; Case Code (Metric): 2012; Number of Terminations: 2; Radiation Hardening: No; Package Quantity: 1; Case Code (Imperial): 0805; Tolerance: 1%; RoHS Compliant: Yes; Contact Plating: Tin; Case/Package: 0805; Max Power Dissipation: 125mW; REACH SVHC: No SVHC; Lead Free: Lead Free; Termination: SMD/SMT; Size Code: 0805; Resistance Tolerance: 1%; Construction: Rectangular; Series: ERJ; Resistor Type: Thick Film; Depth: 1.25mm; Packaging: Tape and Reel; Min Operating Temperature: -55°C; Mount: Surface Mount; Features: Automotive AEC-Q200; Voltage Rating (DC): 150V; Military Standard: Not; Width: 1.2mm; Number of Pins: 2
R21 = CMP-2001-00552-1: Manufacturer: Panasonic; Part Number: ERJ6ENF4703V
R23 = CMP-13261-006466-1: Res Thick Film 0805 8.2kΩ 5% 0.125W ±100ppm/°C Molded SMD T/R; Voltage Rating (DC): 150V; Max Power Dissipation: 125mW; Resistor Type: Thick Film; Height: 0.024inch; Number of Terminations: 2; Length: 0.079inch; Series: RC; Case/Package: 0805; Military Standard: Not; Temperature Coefficient: 100ppm/°C; Case Code (Imperial): 0805; Tolerance: 5%; Lead Free: Lead Free; Construction: Rectangular; Case Code (Metric): 2012; Depth: 1.25mm; Packaging: Tape and Reel; Radiation Hardening: No; RoHS Compliant: Yes; Width: 0.049inch; Min Operating Temperature: -55°C; Contact Plating: Tin; Max Operating Temperature: 155°C; Features: Moisture Resistant
R24 = CMP-1659-00010-2: RES 1.50K OHM 1/8W 1% 0805 SMD; Manufacturer: Yageo; PackageReference: 0805; ComponentLink1URL: http://www.yageo.com/documents/recent/PYu-RC_Group_51_RoHS_L_04.pdf; ComponentLink1Description: Datasheet; PartNumber: RC0805FR-071K5L
R25 = CMP-2001-04326-1: Manufacturer: Vishay Dale; Part Number: WSLP0805R0500FEA
R26-R28 = CMP-2001-00628-1: Manufacturer: Panasonic; Part Number: ERA6AEB331V
R29 R34 R36-R47 = CMP-1659-00013-4: Chip Resistor, 10 KOhm, +/- 1%, 0.125 W, -55 to 155 degC, 0805 (2012 Metric), RoHS, Tape and Reel; Manufacturer: Yageo; Voltage Rating: 150 V; Mount: Surface Mount; ComponentLink1Description: Manufacturer URL; ComponentLink2URL: http://www.yageo.com/documents/recent/PYu-RC_Group_51_RoHS_L_04.pdf; Pins: 2; Length: 2 mm; Min Operating Temperature: -55 degC; Height: 0.5 mm; Mounting Technology: Surface Mount; RoHSCompliant: true; REACH SVHC: No SVHC; ComponentLink1URL: http://www.yageo.com/; Max Operating Temperature: 155 degC; PackageReference: 0805; DatasheetVersion: Rev. 4, 02/2016; Package Quantity: 5000; Packaging: Tape and Reel; ComponentLink2Description: Datasheet; PackageDescription: 2-Pin Surface Mounted Device, Body 2 x 1.25 mm
R30 R31 R33 = CMP-02407-011702-1: RES Thick Film, 100Ω, 1%, 0.5W, 100ppm/°C, 0805; Power Rating: 330mW; Voltage Rating: 150V; Max Power Dissipation: 500mW; Case/Package: 0805; Radiation Hardening: No; Number of Terminations: 2; Features: Automotive AEC-Q200; RoHS Compliant: Yes; Height: 0.5mm; Technology: THICK FILM; Contact Plating: Tin; Series: CRCW-HP; Max Operating Temperature: 155°C; Tolerance: 1%; Package Quantity: 5000; Construction: Rectangular; Width: 1.2mm; Lead Free: Lead Free; Resistor Type: Thick Film; Resistance Tolerance: 1%; Length: 2mm; Weight: 0.000194oz; Termination: SMD/SMT; Depth: 1.25mm; Packaging: Tape and Reel; Voltage Rating (DC): 150V; Case Code (Imperial): 0805; Military Standard: Not; Case Code (Metric): 2012; Mount: Surface Mount; Min Operating Temperature: -55°C; Temperature Coefficient: 100ppm/°C
SW1 = CMP-2000-06501-2: SWITCH SLIDE SPDT 300MA 6V; Switch Function: On-On; Illumination Type: Non-Illuminated; Switch Travel: 2mm; Contact Resistance: 70mR; Actuator Material: Nylon; Electrical Life: 5000Cycles; Actuator Type: Standard; Max Operating Temperature: 85°C; Housing Material: Nylon; Radiation Hardening: No; Max Voltage Rating (DC): 6V; Package Quantity: 1; Case/Package: 100; Actuator Length: 2mm; Min Operating Temperature: -40°C; Contact Current Rating: 300mA; REACH SVHC: No SVHC; Throw Configuration: SPDT; Packaging: Tape and Reel; Contact Material: Copper Alloy; Max Current Rating: 300mA; Current Rating: 300mA; Mount: Surface Mount; Lead Free: Lead Free; Termination: Gull Wing; Voltage Rating (DC): 6V; Length: 9mm; Orientation: Right Angle; Contact Plating: Silver
SW2-SW4 = CMP-2000-07501-1: FSMSM Push Button Switch, 50 mA, -35 to 85 degC, 2-Pin SMD, RoHS, Tape and Reel; Manufacturer: TE Connectivity; Voltage Rating (DC): 24V; Electrical Life: 20000Cycles; Operating Force: 180gf; Switch Travel: 0.25mm; Contact Current Rating: 50mA; Case\/Package: SMD/SMT; Actuator Length: 1.07mm; Throw Configuration: SPST; Actuator Material: Polyamide; Contact Resistance: 100mOhm; Illumination Type: Illuminated; Max Voltage Rating (DC): 12V; Manufacturer URL: http://www.te.com/; Lead Free: LeadFree; Packaging: TapeandReel; Min Operating Temperature: -35degC; Mechanical Life: 20000Cycles; Mount: SurfaceMount; REACH SVHC: Unknown; Package Quantity: 1800; Package Reference: FSMSMTR; RoHSCompliant: true; Max Operating Temperature: 85degC; Orientation: Straight; ELV: Compliant; Datasheet URL: http://www.te.com/commerce/DocumentDelivery/DDEController?Action=showdoc&DocId=Customer+Drawing%7F1437566-3%7FC2%7Fpdf%7FEnglish%7FENG_CD_1437566-3_C2_1437566_3_1_c.dwg.pdf%7F1437566-4; Package Description: 2-Pin Surface Mount Device, Body 6 x 3.5 mm, Pitch 9.19 mm; Current Rating: 50mA; Contact Plating: Silver; Termination: GullWing; Datasheet Version: Rev. C2, 08/2014; Contact Material: Brass; Mounting Technology: SurfaceMount
TP1-TP10 = CMP-00030-00001-3: Soldermask opening or top layer pad for testing purposes
U5 = CMP-04858-000018-1: IC OSC SGL TIMER 100KHZ 8-SOIC; Nominal Supply Current: 4mA; Min Supply Voltage: 4.5V; Max Supply Voltage: 18V; High Level Output Current: -200mA; Quiescent Current: 12mA; Operating Supply Current: 10mA; Number of Timers/Counters: 1; Low Level Output Current: 200mA; Weight: 0.002677oz; Frequency: 100kHz; Lead Free: Lead Free; Supply Current: 4mA; RoHS Compliant: Yes; Package Quantity: 2500; Min Operating Temperature: -55°C; Series: -; Radiation Hardening: No; Contact Plating: Gold; Packaging: Tape and Reel; Case/Package: SOIC; Number of Pins: 8; Mount: Surface Mount; Max Operating Temperature: 125°C; REACH SVHC: No SVHC
U6 = CMP-12131-000005-1: IC OPAMP GP 4 CIRCUIT 14SO; Manufacturer: STMicroelectronics; Voltage Gain: 100dB; Standoff Height: 0.1mm; Bandwidth: 1.3MHz; Max Junction Temp: +150°C; Min Supply Voltage: 3V; Max Dual Supply Voltage: 15V; Min Dual Supply Voltage: 1.5V; Number Of Channels: 4; Nominal Supply Current: 0.7-1.5mA; Output Current Per Channel: 20-50mA; Max Supply Voltage: 30V; Input Offset Voltage: 2mV; Input Bias Current: 0.02uA; Device Class L1: Integrated Circuits (ICs); Device Class L3: Amplifiers - Op Amps; Temperature Range Low: 0°C; Package: SO-14; Temperature Range High: +70°C; Digikey Description: IC OPAMP GP 4 CIRCUIT 14SO; Device Class L2: Linear ICs; Footprint Url: https://www.st.com/content/ccc/resource/technical/document/datasheet/group3/10/8a/e6/12/f8/e8/49/ce/DM00366438/files/DM00366438.pdf/jcr:content/translations/en.DM00366438.pdf; Octopart: https://octopart.com/lm324dt-stmicroelectronics-39579146; ComponentLink2URL: https://www.st.com/content/ccc/resource/technical/document/datasheet/bd/fc/46/43/26/8f/40/7f/CD00001046.pdf/files/CD00001046.pdf/jcr:content/translations/en.CD00001046.pdf; ComponentLink2Description: Datasheet; Lead Free: Yes; Temperature: 0°C to +70°C; RoHS: TRUE; Gain Bandwidth: 1.3MHz; Manufacturer Part Number: LM324DT; Automotive: No; Category: IC; Height: 1.75mm; Mouser Description: LM324 Series 32 V 1.3 MHz Low Power Quad Operational Amplifier - SOIC-14

## Nets that join several sheets
GND: uC_Environment (27 pins), Power_Distribution (21 pins), pulse_generator_pen (8 pins)